# EAGLE schematic rfid_accessctl (EAGLE 7.5.0)
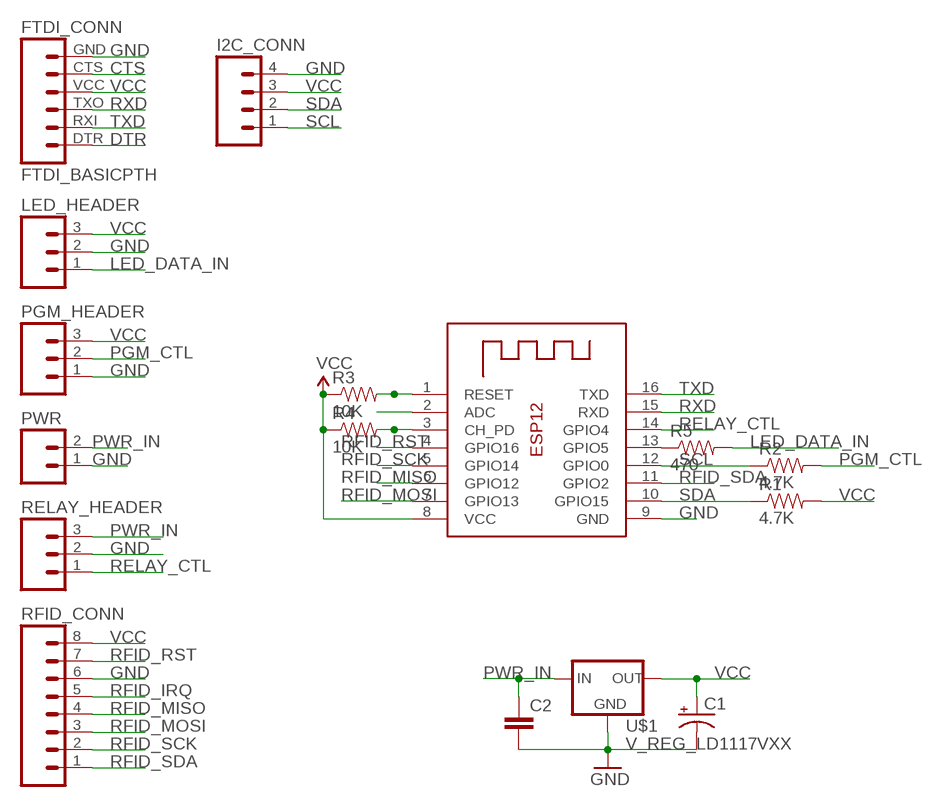
[diagram p0: schematic, sheet 1]

## Parts
C1  10UF-25V-20%(PTH)KIT  [CPOL-RADIAL-10UF-25V-KIT]
C2  0.1UF-50V-20%(PTH)KIT-EZ  [CAP-PTH-SMALL-KIT]
FTDI_CONN  FTDI_BASICPTH  [FTDI_BASIC]
I2C_CONN  M04PTH  [1X04]
LED_HEADER  M03PTH  [1X03]
PGM_HEADER  M03PTH  [1X03]
PWR  M02PTH  [1X02]
R1  4.7K  10KOHM-1/10W-1%(0603)0603  [0603-RES]
R2  4.7K  10KOHM-1/10W-1%(0603)0603  [0603-RES]
R3  10K  10KOHM-1/10W-1%(0603)0603  [0603-RES]
R4  10K  10KOHM-1/10W-1%(0603)0603  [0603-RES]
R5  470  470OHM1/10W1%(0603)  [0603-RES]
RELAY_HEADER  M03PTH  [1X03]
RFID_CONN  M08  [1X08_ROUND]
U$1  V_REG_LD1117VXX  [78XXL]
X1  ESP-12  [ESP-12]

## Nets
CTS: FTDI_CONN.CTS
DTR: FTDI_CONN.DTR
GND: C1.2(-) C2.2 FTDI_CONN.GND I2C_CONN.4 LED_HEADER.2 PGM_HEADER.1 PWR.1 RELAY_HEADER.2 RFID_CONN.6 U$1.IN(GND) X1.9(GND)
LED_DATA_IN: LED_HEADER.1 R5.2
N$1: R3.2 X1.1(RESET)
N$2: X1.2(ADC)
N$3: R5.1 X1.13(GPIO5)
N$8: R4.2 X1.3(CH_PD)
PGM_CTL: PGM_HEADER.2 R2.2
PWR_IN: C2.1 PWR.2 RELAY_HEADER.3 U$1.OUT(IN)
RELAY_CTL: RELAY_HEADER.1 X1.14(GPIO4)
RFID_IRQ: RFID_CONN.5
RFID_MISO: RFID_CONN.4 X1.6(GPIO12)
RFID_MOSI: RFID_CONN.3 X1.7(GPIO13)
RFID_RST: RFID_CONN.7 X1.4(GPIO16)
RFID_SCK: RFID_CONN.2 X1.5(GPIO14)
RFID_SDA: RFID_CONN.1 X1.11(GPIO2)
RXD: FTDI_CONN.TXO X1.15(RXD)
SCL: I2C_CONN.1 R2.1 X1.12(GPIO0)
SDA: I2C_CONN.2 R1.1 X1.10(GPIO15)
TXD: FTDI_CONN.RXI X1.16(TXD)
VCC: C1.1(+) FTDI_CONN.VCC I2C_CONN.3 LED_HEADER.3 PGM_HEADER.3 R1.2 R3.1 R4.1 RFID_CONN.8 U$1.GND(OUT) X1.8(VCC)

## Library data of the parts
C1 = SparkFun-Capacitors:10UF-25V-20%(PTH): CAP-08440; PROD_ID: CAP-08440
C2 = SparkFun-Capacitors:0.1UF-50V-20%(PTH): CAP-08370; PROD_ID: CAP-08370
FTDI_CONN = SparkFun-Connectors:FTDI_BASIC: FTDI Basic header with labels
I2C_CONN = SparkFun-Connectors:M04: Header 4 Standard 4-pin 0.1" header. Use with straight break away headers (SKU : PRT-00116), right angle break away headers (PRT-00553), swiss pins (PRT-00743), machine pins (PRT-00117), and female headers (PRT-00115). Molex polarized connector foot print use with SKU : PRT-08231 with associated crimp pins and housings. 1MM SMD Version SKU: PRT-10208
LED_HEADER PGM_HEADER RELAY_HEADER = SparkFun-Connectors:M03: Header 3 Standard 3-pin 0.1" header. Use with straight break away headers (SKU : PRT-00116), right angle break away headers (PRT-00553), swiss pins (PRT-00743), machine pins (PRT-00117), and female headers (PRT-00115). Molex polarized connector foot print use with SKU : PRT-08232 with associated crimp pins and housings.
PWR = SparkFun-Connectors:M02: Standard 2-pin 0.1" header. Use with - straight break away headers ( PRT-00116) - right angle break away headers (PRT-00553) - swiss pins (PRT-00743) - machine pins (PRT-00117) - female headers (PRT-00115) Molex polarized connector foot print use with: PRT-08233 with associated crimp pins and housings. 2.54_SCREWTERM for use with PRT-10571. 3.5mm Screw Terminal footprints for PRT-08084 5mm Screw Terminal footprints for use with PRT-08432
R1 R2 = SparkFun-Resistors:10KOHM-1/10W-1%(0603): RES-00824; PROD_ID: RES-00824; VALUE: 10K
R3 R4 = SparkFun-Resistors:10KOHM-1/10W-1%(0603): RES-00824; PROD_ID: RES-00824
R5 = SparkFun-Resistors:470OHM1/10W1%(0603): RES-07869; PROD_ID: RES-07869
RFID_CONN = SparkFun-Connectors:M08: Header 8 Standard 8-pin 0.1" header. Use with straight break away headers (SKU : PRT-00116), right angle break away headers (PRT-00553), swiss pins (PRT-00743), machine pins (PRT-00117), and female headers (PRT-00115).
U$1 = SparkFun-PowerIC:V_REG_LD1117VXX: LD1117VXX voltage regulator. We carry the 3.3V version (COM-00526) in TO-220 package.
X1 = adafruit:ESP-12